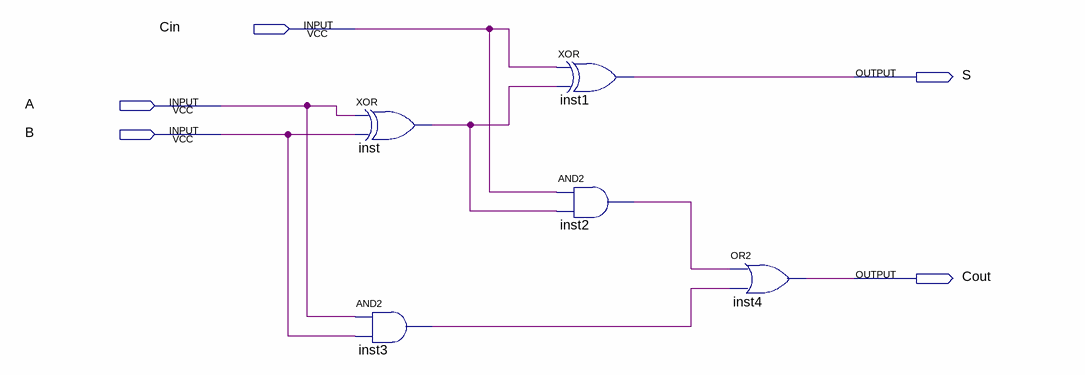
[diagram p0: schematic sheet]
// Quartus schematic bitAdder.bdf as structural Verilog: 5 symbols, 5 pins
module bitAdder (
  input  Cin,
  input  A,
  input  B,
  output S,
  output Cout
);

  wire inst2_out, inst3_out, inst_out;

  xor inst (inst_out, A, B);
  and inst3 (inst3_out, A, B);
  xor inst1 (S, Cin, inst_out);
  and inst2 (inst2_out, Cin, inst_out);
  or inst4 (Cout, inst2_out, inst3_out);
endmodule
